# Altium schematic sheet schematic.SchDoc
size A1; SheetNumber: 1; SheetTotal: 1
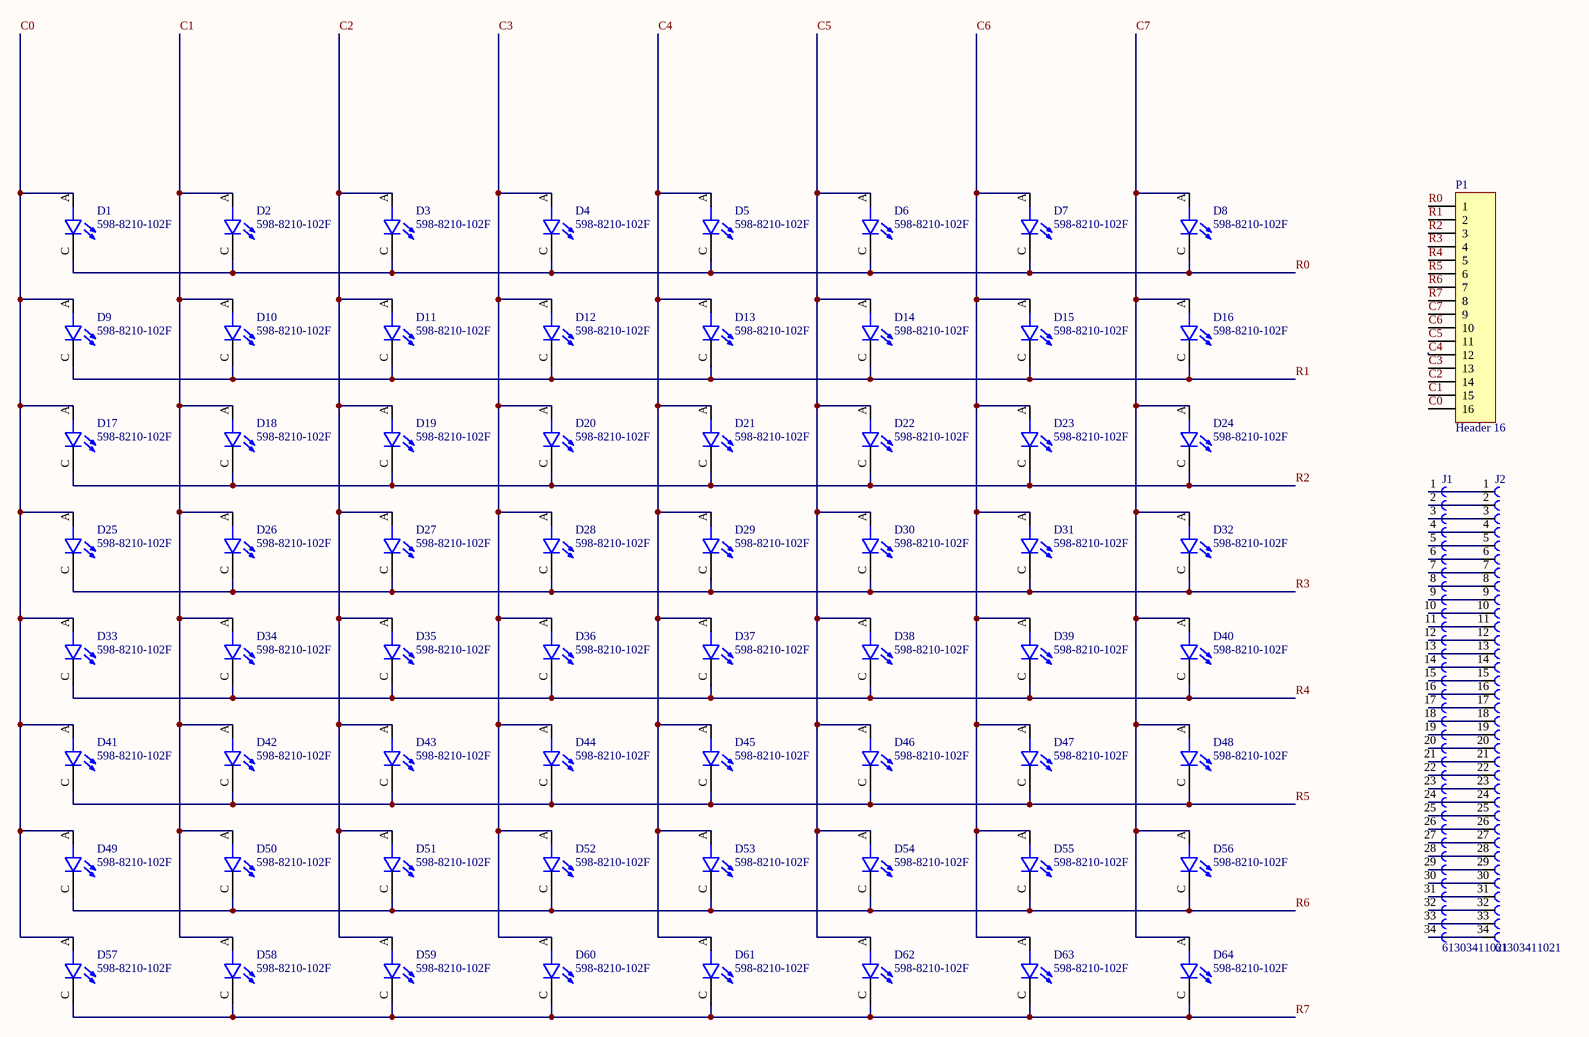
[diagram p0: schematic.SchDoc]

## Parts
D1  598-8210-102F  [LEDSC160X320X90-2N]
D2  598-8210-102F  [LEDSC160X320X90-2N]
D3  598-8210-102F  [LEDSC160X320X90-2N]
D4  598-8210-102F  [LEDSC160X320X90-2N]
D5  598-8210-102F  [LEDSC160X320X90-2N]
D6  598-8210-102F  [LEDSC160X320X90-2N]
D7  598-8210-102F  [LEDSC160X320X90-2N]
D8  598-8210-102F  [LEDSC160X320X90-2N]
D9  598-8210-102F  [LEDSC160X320X90-2N]
D10  598-8210-102F  [LEDSC160X320X90-2N]
D11  598-8210-102F  [LEDSC160X320X90-2N]
D12  598-8210-102F  [LEDSC160X320X90-2N]
D13  598-8210-102F  [LEDSC160X320X90-2N]
D14  598-8210-102F  [LEDSC160X320X90-2N]
D15  598-8210-102F  [LEDSC160X320X90-2N]
D16  598-8210-102F  [LEDSC160X320X90-2N]
D17  598-8210-102F  [LEDSC160X320X90-2N]
D18  598-8210-102F  [LEDSC160X320X90-2N]
D19  598-8210-102F  [LEDSC160X320X90-2N]
D20  598-8210-102F  [LEDSC160X320X90-2N]
D21  598-8210-102F  [LEDSC160X320X90-2N]
D22  598-8210-102F  [LEDSC160X320X90-2N]
D23  598-8210-102F  [LEDSC160X320X90-2N]
D24  598-8210-102F  [LEDSC160X320X90-2N]
D25  598-8210-102F  [LEDSC160X320X90-2N]
D26  598-8210-102F  [LEDSC160X320X90-2N]
D27  598-8210-102F  [LEDSC160X320X90-2N]
D28  598-8210-102F  [LEDSC160X320X90-2N]
D29  598-8210-102F  [LEDSC160X320X90-2N]
D30  598-8210-102F  [LEDSC160X320X90-2N]
D31  598-8210-102F  [LEDSC160X320X90-2N]
D32  598-8210-102F  [LEDSC160X320X90-2N]
D33  598-8210-102F  [LEDSC160X320X90-2N]
D34  598-8210-102F  [LEDSC160X320X90-2N]
D35  598-8210-102F  [LEDSC160X320X90-2N]
D36  598-8210-102F  [LEDSC160X320X90-2N]
D37  598-8210-102F  [LEDSC160X320X90-2N]
D38  598-8210-102F  [LEDSC160X320X90-2N]
D39  598-8210-102F  [LEDSC160X320X90-2N]
D40  598-8210-102F  [LEDSC160X320X90-2N]
D41  598-8210-102F  [LEDSC160X320X90-2N]
D42  598-8210-102F  [LEDSC160X320X90-2N]
D43  598-8210-102F  [LEDSC160X320X90-2N]
D44  598-8210-102F  [LEDSC160X320X90-2N]
D45  598-8210-102F  [LEDSC160X320X90-2N]
D46  598-8210-102F  [LEDSC160X320X90-2N]
D47  598-8210-102F  [LEDSC160X320X90-2N]
D48  598-8210-102F  [LEDSC160X320X90-2N]
D49  598-8210-102F  [LEDSC160X320X90-2N]
D50  598-8210-102F  [LEDSC160X320X90-2N]
D51  598-8210-102F  [LEDSC160X320X90-2N]
D52  598-8210-102F  [LEDSC160X320X90-2N]
D53  598-8210-102F  [LEDSC160X320X90-2N]
D54  598-8210-102F  [LEDSC160X320X90-2N]
D55  598-8210-102F  [LEDSC160X320X90-2N]
D56  598-8210-102F  [LEDSC160X320X90-2N]
D57  598-8210-102F  [LEDSC160X320X90-2N]
D58  598-8210-102F  [LEDSC160X320X90-2N]
D59  598-8210-102F  [LEDSC160X320X90-2N]
D60  598-8210-102F  [LEDSC160X320X90-2N]
D61  598-8210-102F  [LEDSC160X320X90-2N]
D62  598-8210-102F  [LEDSC160X320X90-2N]
D63  598-8210-102F  [LEDSC160X320X90-2N]
D64  598-8210-102F  [LEDSC160X320X90-2N]
J1  61303411021  [61303411021]
J2  61303411021  [61303411021]
P1  Header 16  [HDR1X16]

## Nets
C0: D1.A D9.A D17.A D25.A D33.A D41.A D49.A D57.A P1.16
C1: D2.A D10.A D18.A D26.A D34.A D42.A D50.A D58.A P1.15
C2: D3.A D11.A D19.A D27.A D35.A D43.A D51.A D59.A P1.14
C3: D4.A D12.A D20.A D28.A D36.A D44.A D52.A D60.A P1.13
C4: D5.A D13.A D21.A D29.A D37.A D45.A D53.A D61.A P1.12
C5: D6.A D14.A D22.A D30.A D38.A D46.A D54.A D62.A P1.11
C6: D7.A D15.A D23.A D31.A D39.A D47.A D55.A D63.A P1.10
C7: D8.A D16.A D24.A D32.A D40.A D48.A D56.A D64.A P1.9
R0: D1.C D2.C D3.C D4.C D5.C D6.C D7.C D8.C P1.1
R1: D9.C D10.C D11.C D12.C D13.C D14.C D15.C D16.C P1.2
R2: D17.C D18.C D19.C D20.C D21.C D22.C D23.C D24.C P1.3
R3: D25.C D26.C D27.C D28.C D29.C D30.C D31.C D32.C P1.4
R4: D33.C D34.C D35.C D36.C D37.C D38.C D39.C D40.C P1.5
R5: D41.C D42.C D43.C D44.C D45.C D46.C D47.C D48.C P1.6
R6: D49.C D50.C D51.C D52.C D53.C D54.C D55.C D56.C P1.7
R7: D57.C D58.C D59.C D60.C D61.C D62.C D63.C D64.C P1.8
NetJ1_1: J1.1 J2.1
NetJ1_2: J1.2 J2.2
NetJ1_3: J1.3 J2.3
NetJ1_4: J1.4 J2.4
NetJ1_5: J1.5 J2.5
NetJ1_6: J1.6 J2.6
NetJ1_7: J1.7 J2.7
NetJ1_8: J1.8 J2.8
NetJ1_9: J1.9 J2.9
NetJ1_10: J1.10 J2.10
NetJ1_11: J1.11 J2.11
NetJ1_12: J1.12 J2.12
NetJ1_13: J1.13 J2.13
NetJ1_14: J1.14 J2.14
NetJ1_15: J1.15 J2.15
NetJ1_16: J1.16 J2.16
NetJ1_17: J1.17 J2.17
NetJ1_18: J1.18 J2.18
NetJ1_19: J1.19 J2.19
NetJ1_20: J1.20 J2.20
NetJ1_21: J1.21 J2.21
NetJ1_22: J1.22 J2.22
NetJ1_23: J1.23 J2.23
NetJ1_24: J1.24 J2.24
NetJ1_25: J1.25 J2.25
NetJ1_26: J1.26 J2.26
NetJ1_27: J1.27 J2.27
NetJ1_28: J1.28 J2.28
NetJ1_29: J1.29 J2.29
NetJ1_30: J1.30 J2.30
NetJ1_31: J1.31 J2.31
NetJ1_32: J1.32 J2.32
NetJ1_33: J1.33 J2.33
NetJ1_34: J1.34 J2.34

## Library data of the parts
D1-D64 = 598-8210-102F: Red 635nm LED Indication - Discrete 2V 1206 (3216 Metric); MF: {'manufacturer': u'Dialight'}; Value: *; Package: None; MP: 598-8210-102F; Price: None; Availability: Unavailable
J1 J2 = 61303411021: <b> WR-PHD 2.54mm Angled Pin Header, 34 Pins/<b>=>Con_BTB_PHD_2.54_1_THT_61303411021 <br><a href="http://katalog.we-online.de/media/images/eican/Con_BTB_PHD_2.54_1_THT_61303211021_pf2.jpg" title="Enlarge picture"> <img src="http://katalog.we-online.de/media/thumbs2/eican/thb_Con_BTB_PHD_2.54_1_THT_61303211021_pf2.jpg" width="320"></a><p> Details see: <a href="http://katalog.we-online.de/en/em/613_0xx_110_21">http://katalog.we-online.de/en/em/613_0xx_110_21</a><p> Created 2014-05-29, Karrer Zheng<br> 2014 (C) WÃ¼rth Elektronik; MF: {'manufacturer': u'W\xfcrth Elektronik'}; Value: *; MP: 61303411021; Package: None; Availability: Unavailable; Price: None
P1 = Header 16: Header, 16-Pin; LatestRevisionDate: 17-Jul-2002; LatestRevisionNote: Re-released for DXP Platform.; Publisher: Altium Limited